# Altium schematic sheet SubCardConnect.SchDoc
size A3; DocumentNumber: 5; SheetNumber: 5; SheetTotal: 7
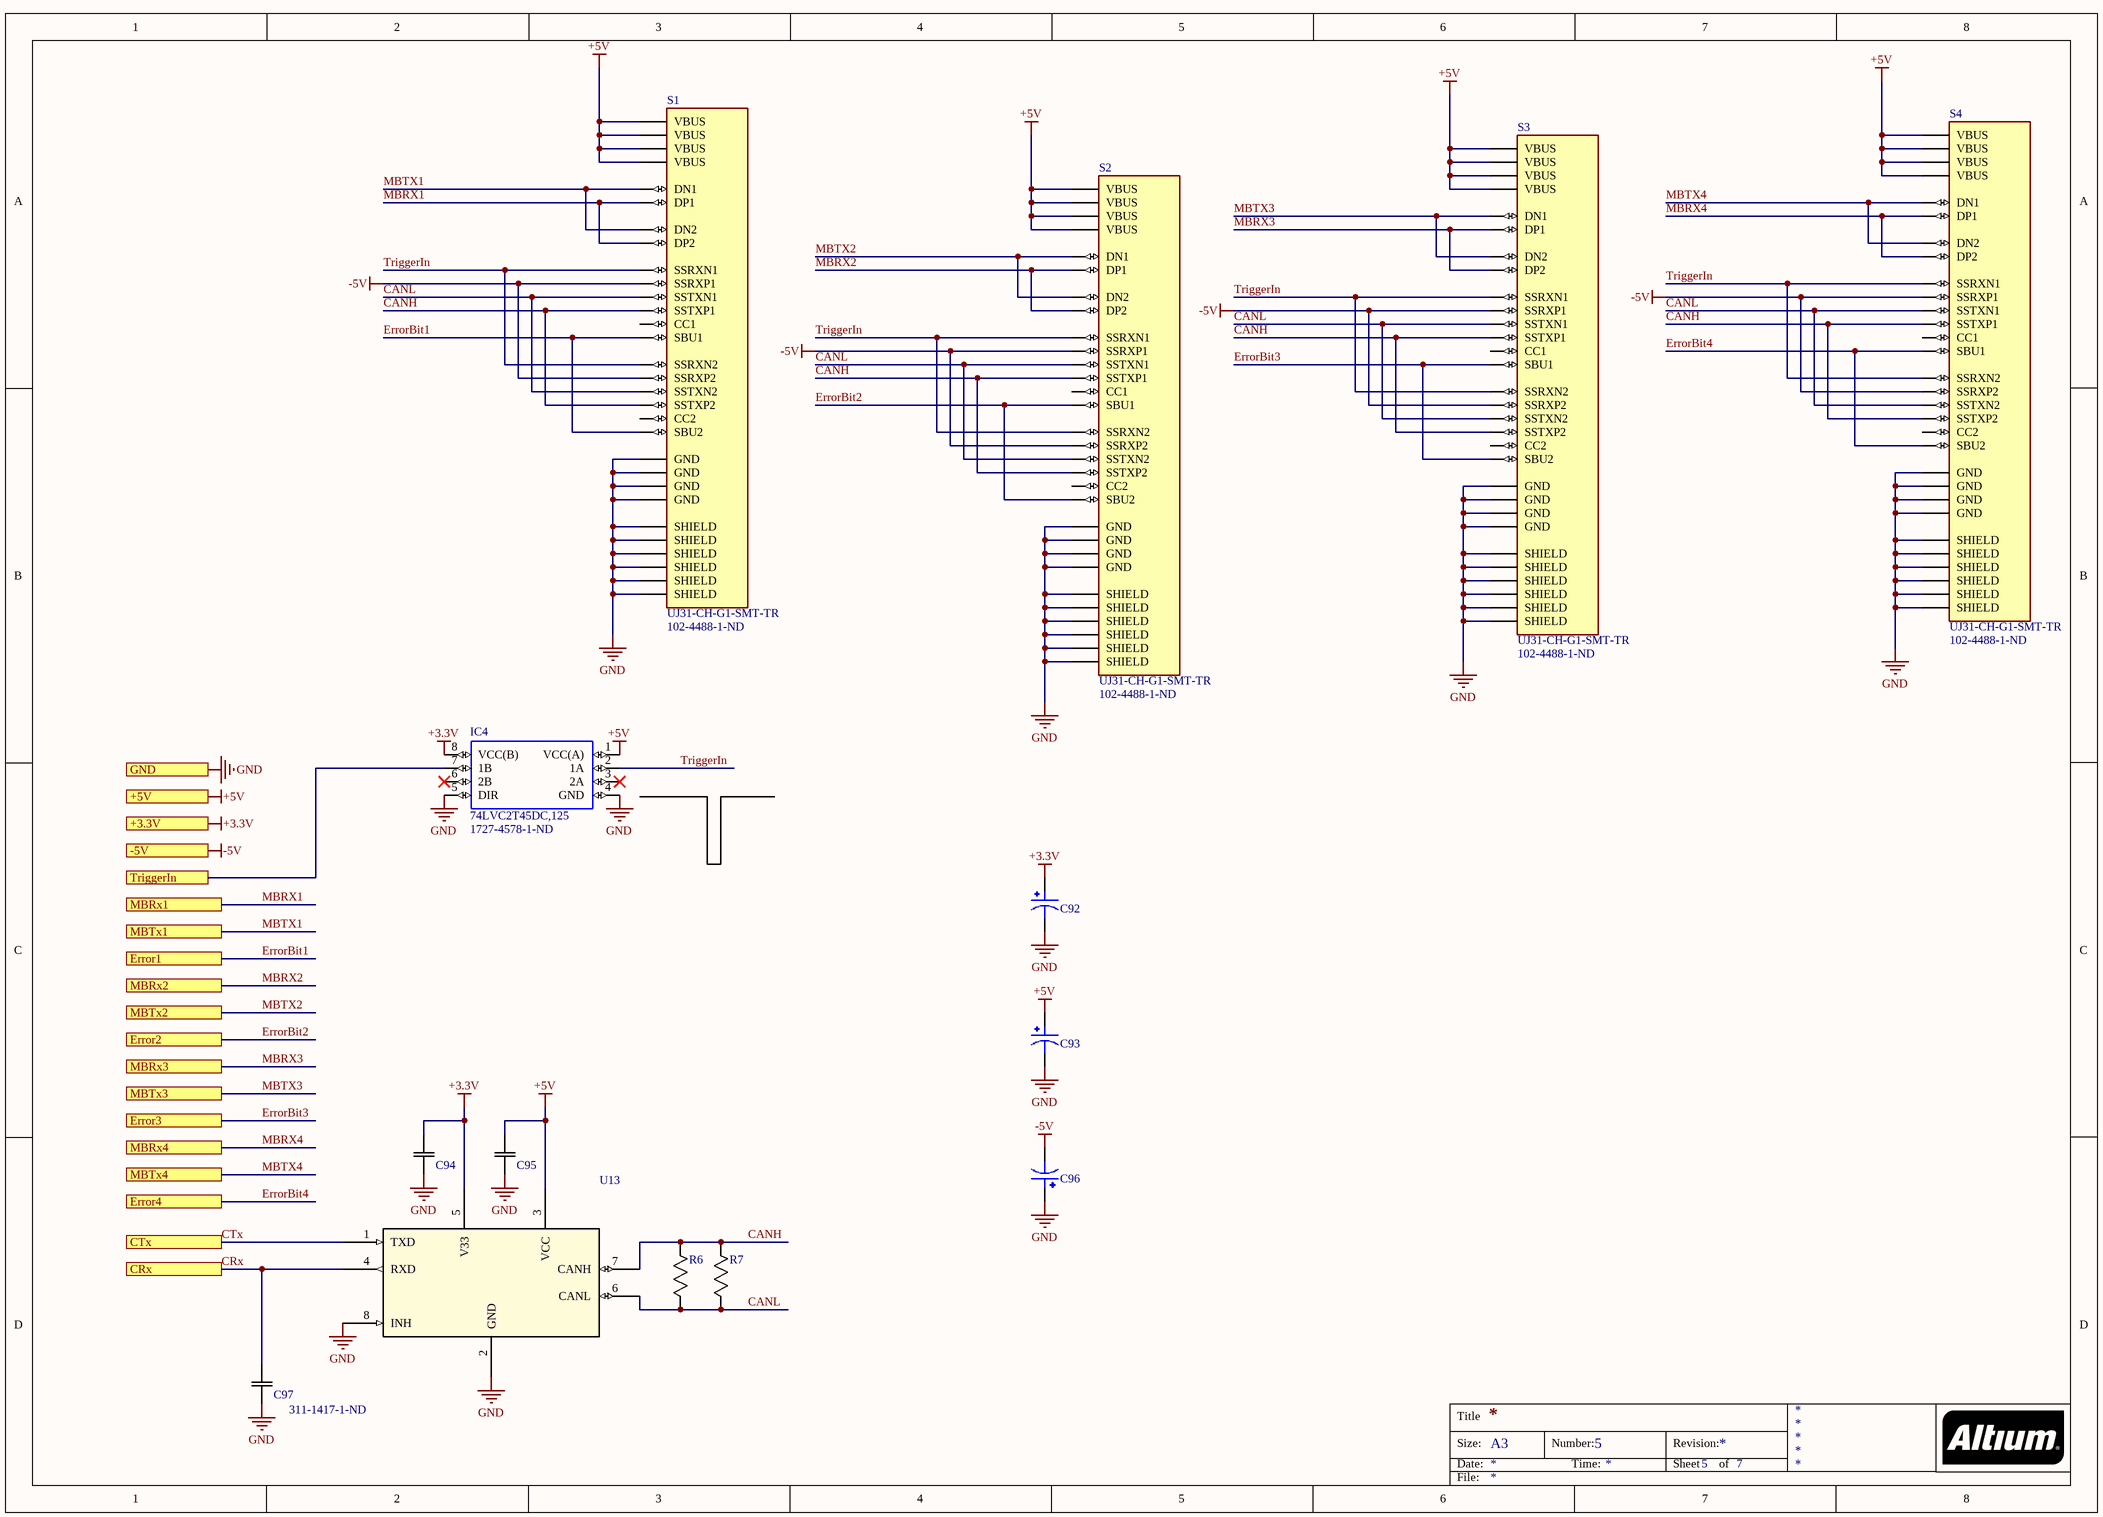
[diagram p0: SubCardConnect.SchDoc]

## Parts
C92  T55A107M6R3C0200  [C1206]  (value not drawn)
C93  T55A107M6R3C0200  [C1206]  (value not drawn)
C94  GRM155R71C103MA01D  [C0402]  (value not drawn)
C95  GRM155R71C103MA01D  [C0402]  (value not drawn)
C96  T55A107M6R3C0200  [C1206]  (value not drawn)
C97  Supplier Part Number 1: 311-1417-1-ND  [C0402]  (hidden comment: CC0402JRNPO9BN200)
IC4  74LVC2T45DC,125  Supplier Part Number 1: 1727-4578-1-ND  [SOP50P310X100-8N]
R6  CRGCQ0805F120R  [0805]  (value not drawn)
R7  CRGCQ0805F120R  [0805]  (value not drawn)
S1  UJ31-CH-G1-SMT-TR  Supplier Part Number 1: 102-4488-1-ND  [CUI_UJ31-CH-G1-SMT-TR]
S2  UJ31-CH-G1-SMT-TR  Supplier Part Number 1: 102-4488-1-ND  [CUI_UJ31-CH-G1-SMT-TR]
S3  UJ31-CH-G1-SMT-TR  Supplier Part Number 1: 102-4488-1-ND  [CUI_UJ31-CH-G1-SMT-TR]
S4  UJ31-CH-G1-SMT-TR  Supplier Part Number 1: 102-4488-1-ND  [CUI_UJ31-CH-G1-SMT-TR]
U13  IFX1050GVIOXUMA1  [SOIC127P600X175-8N]  (value not drawn)

## Ports
+3.3V, +5V, -5V, CRx, CTx, Error1, Error2, Error3, Error4, GND, MBRx1, MBRx2, MBRx3, MBRx4, MBTx1, MBTx2, MBTx3, MBTx4, TriggerIn

## Nets
+3.3V: C92.1(POS) C94.2 IC4.8(VCC(B)) U13.5(V33) ; port +3.3V
+5V: C93.1(POS) C95.2 IC4.1(VCC(A)) S1.A4(VBUS) S1.A9(VBUS) S1.B4(VBUS) S1.B9(VBUS) S2.A4(VBUS) S2.A9(VBUS) S2.B4(VBUS) S2.B9(VBUS) S3.A4(VBUS) S3.A9(VBUS) S3.B4(VBUS) S3.B9(VBUS) S4.A4(VBUS) S4.A9(VBUS) S4.B4(VBUS) S4.B9(VBUS) U13.3(VCC) ; port +5V
-5V: C96.2(NEG) S1.A11(SSRXP2) S1.B11(SSRXP1) S2.A11(SSRXP2) S2.B11(SSRXP1) S3.A11(SSRXP2) S3.B11(SSRXP1) S4.A11(SSRXP2) S4.B11(SSRXP1) ; port -5V
GND: C92.2(NEG) C93.2(NEG) C94.1 C95.1 C96.1(POS) C97.1 IC4.4(GND) IC4.5(DIR) S1.A1(GND) S1.A12(GND) S1.B1(GND) S1.B12(GND) S1.SH1(SHIELD) S1.SH2(SHIELD) S1.SH3(SHIELD) S1.SH4(SHIELD) S1.SH5(SHIELD) S1.SH6(SHIELD) S2.A1(GND) S2.A12(GND) S2.B1(GND) S2.B12(GND) S2.SH1(SHIELD) S2.SH2(SHIELD) S2.SH3(SHIELD) S2.SH4(SHIELD) S2.SH5(SHIELD) S2.SH6(SHIELD) S3.A1(GND) S3.A12(GND) S3.B1(GND) S3.B12(GND) S3.SH1(SHIELD) S3.SH2(SHIELD) S3.SH3(SHIELD) S3.SH4(SHIELD) S3.SH5(SHIELD) S3.SH6(SHIELD) S4.A1(GND) S4.A12(GND) S4.B1(GND) S4.B12(GND) S4.SH1(SHIELD) S4.SH2(SHIELD) S4.SH3(SHIELD) S4.SH4(SHIELD) S4.SH5(SHIELD) S4.SH6(SHIELD) U13.2(GND) U13.8(INH) ; port GND
CANH: R6.2 R7.2 S1.A2(SSTXP1) S1.B2(SSTXP2) S2.A2(SSTXP1) S2.B2(SSTXP2) S3.A2(SSTXP1) S3.B2(SSTXP2) S4.A2(SSTXP1) S4.B2(SSTXP2) U13.7(CANH)
CANL: R6.1 R7.1 S1.A3(SSTXN1) S1.B3(SSTXN2) S2.A3(SSTXN1) S2.B3(SSTXN2) S3.A3(SSTXN1) S3.B3(SSTXN2) S4.A3(SSTXN1) S4.B3(SSTXN2) U13.6(CANL)
CRx: C97.2 U13.4(RXD) ; port CRx
CTx: U13.1(TXD) ; port CTx
ErrorBit1: S1.A8(SBU1) S1.B8(SBU2) ; port Error1
ErrorBit2: S2.A8(SBU1) S2.B8(SBU2) ; port Error2
ErrorBit3: S3.A8(SBU1) S3.B8(SBU2) ; port Error3
ErrorBit4: S4.A8(SBU1) S4.B8(SBU2) ; port Error4
MBRX1: S1.A6(DP1) S1.B6(DP2) ; port MBRx1
MBRX2: S2.A6(DP1) S2.B6(DP2) ; port MBRx2
MBRX3: S3.A6(DP1) S3.B6(DP2) ; port MBRx3
MBRX4: S4.A6(DP1) S4.B6(DP2) ; port MBRx4
MBTX1: S1.A7(DN1) S1.B7(DN2) ; port MBTx1
MBTX2: S2.A7(DN1) S2.B7(DN2) ; port MBTx2
MBTX3: S3.A7(DN1) S3.B7(DN2) ; port MBTx3
MBTX4: S4.A7(DN1) S4.B7(DN2) ; port MBTx4
TriggerIn: IC4.2(1A) S1.A10(SSRXN2) S1.B10(SSRXN1) S2.A10(SSRXN2) S2.B10(SSRXN1) S3.A10(SSRXN2) S3.B10(SSRXN1) S4.A10(SSRXN2) S4.B10(SSRXN1)
TriggerIn: IC4.7(1B) ; port TriggerIn  [a separate net that carries the same name]

Not connected (* = marked no-connect by the designer): IC4 3(2A)* 6(2B)*; S1 A5(CC1) B5(CC2); S2 A5(CC1) B5(CC2); S3 A5(CC1) B5(CC2); S4 A5(CC1) B5(CC2)

## Notes on the sheet
- Title
- Size:
- Date:
- A3
- Number:
- Time:
- Revision:
- Sheet
- of
- File:

## Library data of the parts
C92 C93 C96 = Cap_1206: Tantalium; Supplier 1: Mouser; Supplier Part Number 1: 74-T55A107M6R3C0200
C94 C95 C97 = Cap_0402: Supplier 1: Digi-Key
  C94 C95: Supplier Part Number 1: 490-16353-1-ND
IC4 = 74LVC2T45DC,125: Voltage Level Translator Bidirectional 1 Circuit 2 Channel 420Mbps 8-VSSOP; MF: Nexperia USA; MP: 74LVC2T45DC,125; Value: *; Availability: Good; Package: VSSOP8-8 Nexperia USA Inc.; Check_prices: https://www.snapeda.com/parts/74LVC2T45DC,125/Nexperia/view-part/287401/?ref=eda; Price: None; SnapEDA_Link: https://www.snapeda.com/parts/74LVC2T45DC,125/Nexperia/view-part/287401/?ref=snap; Purchase-URL: https://pricing.snapeda.com/search/part/74LVC2T45DC,125/?ref=eda; Supplier 1: Digi-Key
R6 R7 = Res_0805: Supplier 1: Digi-Key; Supplier Part Number 1: A129738CT-ND
S1-S4 = UJ31-CH-G1-SMT-TR: Type C, USB 3.1 Gen 2, 5 A, Right Angle, Surface Mount _SMT_ , USB Receptacle; MF: CUI Devices; CUI_purchase_URL: https://www.cuidevices.com/product/interconnect/connectors/usb-connectors/uj31-ch-g1-smt-tr?utm_source=snapeda.com&utm_medium=referral&utm_campaign=snapedaBOM; Price: None; SnapEDA_Link: https://www.snapeda.com/parts/UJ31-CH-G1-SMT-TR/CUI%20Devices/view-part/2754415/?ref=snap; Package: None; Availability: Unavailable; Value: *; MP: UJ31-CH-G1-SMT-TR; Supplier 1: Digi-Key
U13 = IFX1050GVIOXUMA1: No Description Available; Vendor: Infineon; Built_By: EMA_UL_Team; SourceLibrary: Infineon_2014-07-30; Manufacturer_Part_Number: IFX1050G; Copyright: Copyright (C) 2018 Accelerated Designs. All rights reserved; RefDes: RefDes; Type: DEV; Supplier 1: Digi-Key; Supplier Part Number 1: IFX1050GVIOXUMA1CT-ND